# EAGLE schematic main (EAGLE 6.5.0)
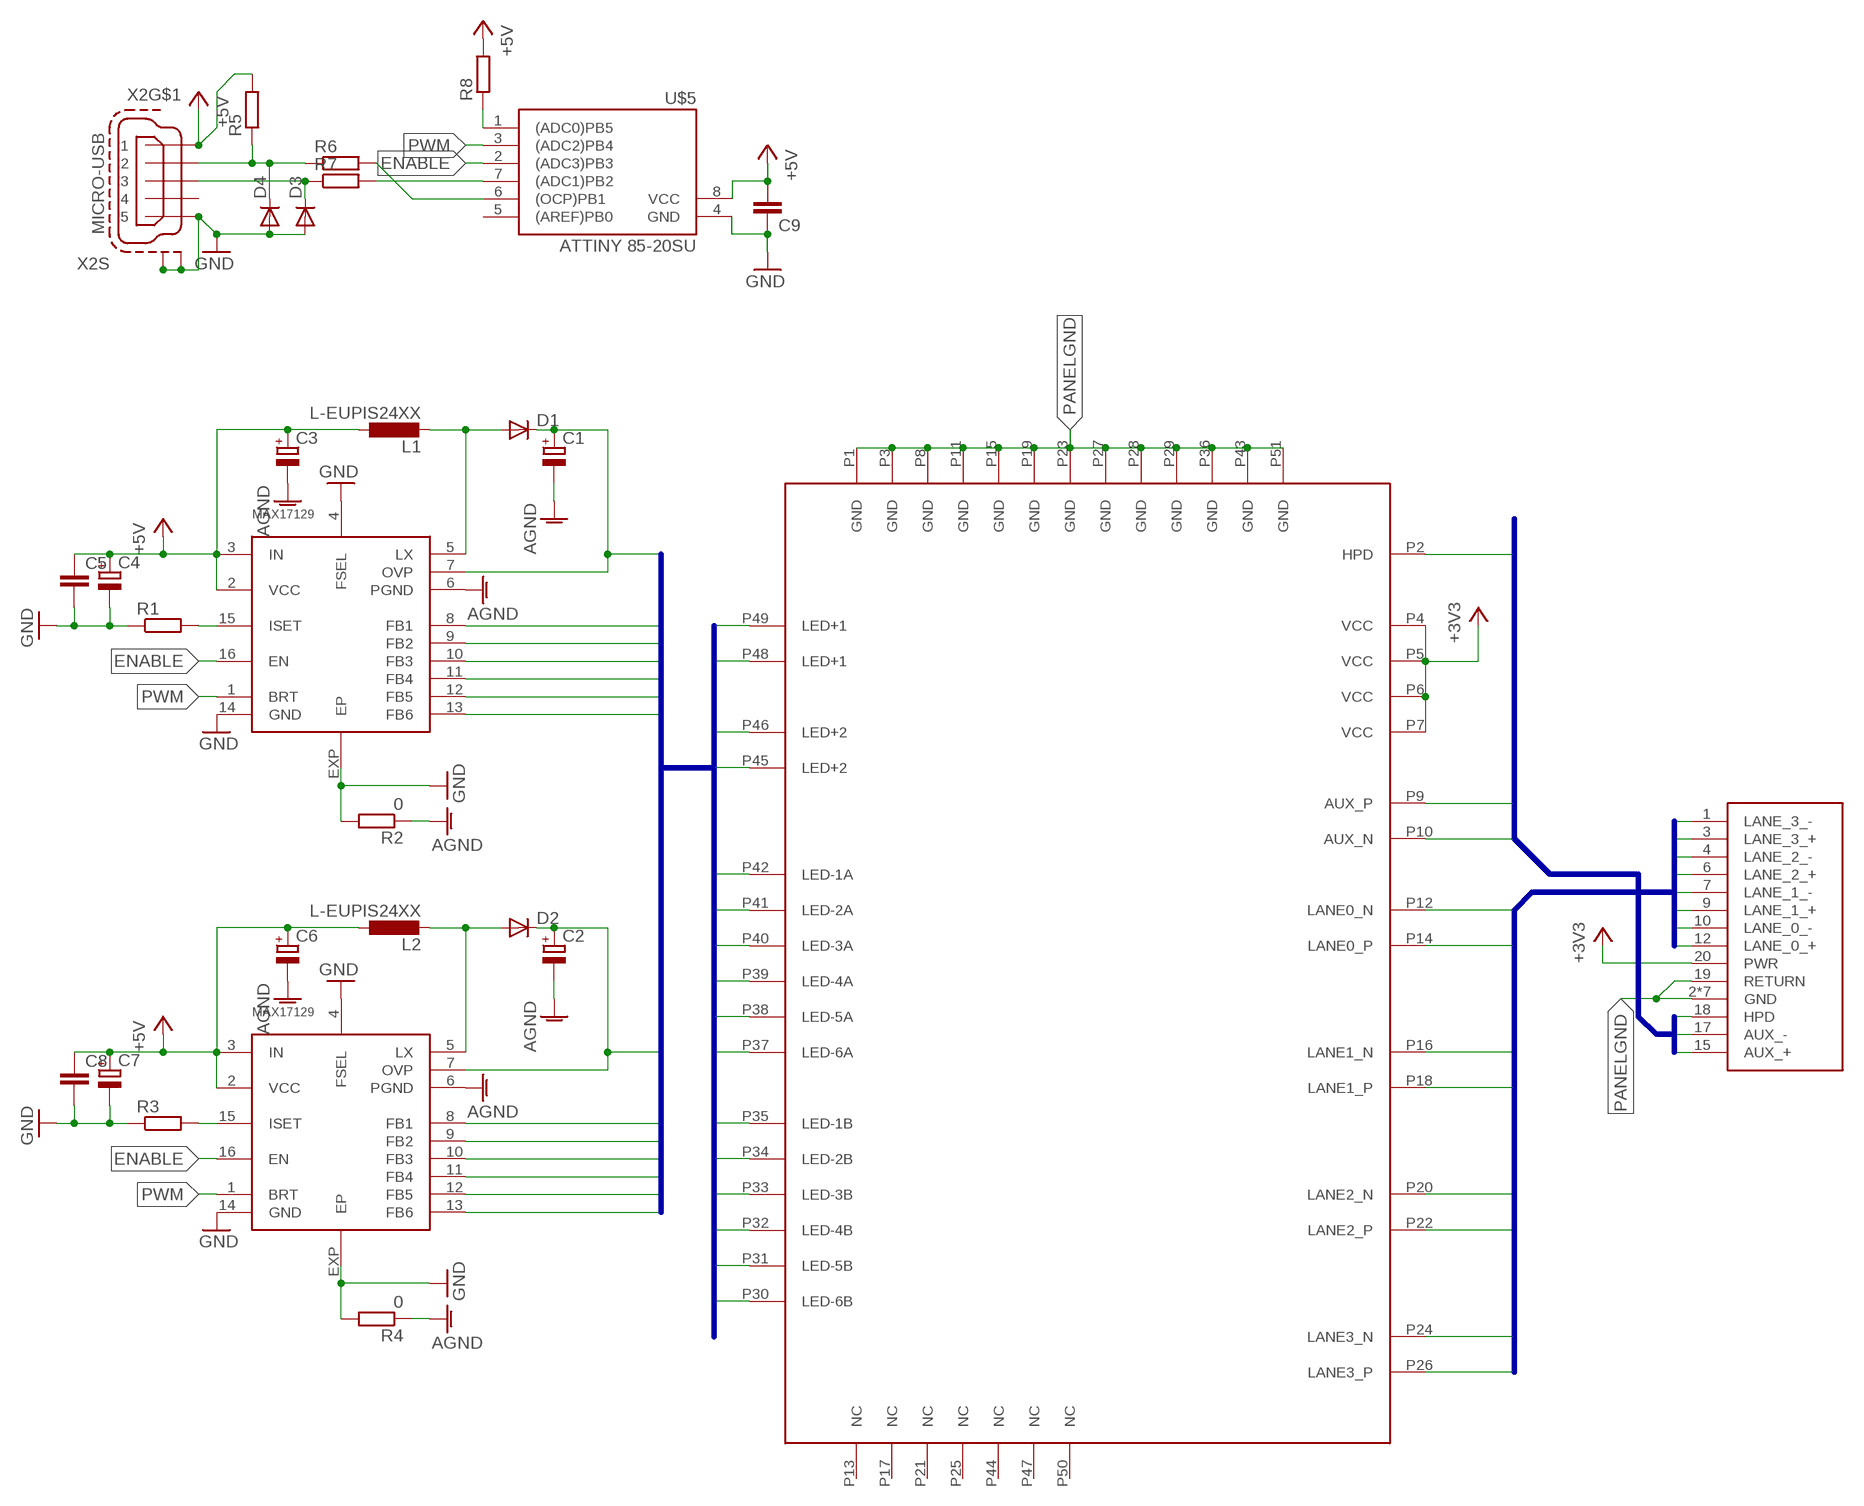
[diagram p0: schematic, sheet 1]

## Parts
C1  CPOL-EUB  [PANASONIC_B]
C2  CPOL-EUB  [PANASONIC_B]
C3  CPOL-EUB  [PANASONIC_B]
C4  CPOL-EUB  [PANASONIC_B]
C5  C-EUC0805  [C0805]
C6  CPOL-EUB  [PANASONIC_B]
C7  CPOL-EUB  [PANASONIC_B]
C8  C-EUC0805  [C0805]
C9  C-EUC0805  [C0805]
D1  DIODE-DO214AA  [DO214AA]
D2  DIODE-DO214AA  [DO214AA]
D3  DIODE-MINIMELF  [MINIMELF]
D4  DIODE-MINIMELF  [MINIMELF]
L1  L-EUPIS24XX  [PIS24XX]
L2  L-EUPIS24XX  [PIS24XX]
R1  R-EU_M0805  [M0805]
R2  0  R-EU_R0201  [R0201]
R3  R-EU_M0805  [M0805]
R4  0  R-EU_R0201  [R0201]
R5  R-EU_R0805  [R0805]
R6  R-EU_R0805  [R0805]
R7  R-EU_R0805  [R0805]
R8  R-EU_R0805  [R0805]
U$1  IPAD3-CONN  [MOLEX502250-5191]
U$2  DP1R020JQ1SINK  [DP1R020JQ1]
U$3  MAX17129  [QFN16-4X4]
U$4  MAX17129  [QFN16-4X4]
U$5  ATTINY 85-20SU  TINY25/45/85-20SU  [SOIC8]
X2  MICRO-USB  [SMD]

## Nets
+3V3: U$1.P4(VCC) U$1.P5(VCC) U$1.P6(VCC) U$1.P7(VCC) U$2.20(PWR)
+5V: C3.+ C4.+ C5.1 C6.+ C7.+ C8.1 C9.2 L1.2 L2.2 R5.2 R8.2 U$3.2(VCC) U$3.3(IN) U$4.2(VCC) U$4.3(IN) U$5.8(VCC) X2.1
AGND: C1.- C2.- C3.- C6.- R2.1 R4.1 U$3.6(PGND) U$4.6(PGND)
AUX_N: U$1.P10(AUX_N) U$2.17(AUX_-)
AUX_P: U$1.P9(AUX_P) U$2.15(AUX_+)
ENABLE: U$3.16(EN) U$4.16(EN) U$5.2((ADC3)PB3)
GND: C4.- C5.2 C7.- C8.2 C9.1 D3.A D4.A R1.1 R2.2 R3.1 R4.2 U$3.4(FSEL) U$3.14(GND) U$3.EXP(EP) U$4.4(FSEL) U$4.14(GND) U$4.EXP(EP) U$5.4(GND) X2.5 X2.GNDA(S:S1) X2.GNDB(S:S2)
HPD: U$1.P2(HPD) U$2.18(HPD)
LANE0_N: U$1.P12(LANE0_N) U$2.10(LANE_0_-)
LANE0_P: U$1.P14(LANE0_P) U$2.12(LANE_0_+)
LANE1_N: U$1.P16(LANE1_N) U$2.7(LANE_1_-)
LANE1_P: U$1.P18(LANE1_P) U$2.9(LANE_1_+)
LANE2_N: U$1.P20(LANE2_N) U$2.4(LANE_2_-)
LANE2_P: U$1.P22(LANE2_P) U$2.6(LANE_2_+)
LANE3_N: U$1.P24(LANE3_N) U$2.1(LANE_3_-)
LANE3_P: U$1.P26(LANE3_P) U$2.3(LANE_3_+)
LED_N_A_1: U$1.P42(LED-1A) U$3.8(FB1)
LED_N_A_2: U$1.P41(LED-2A) U$3.11(FB4)
LED_N_A_3: U$1.P40(LED-3A) U$3.9(FB2)
LED_N_A_4: U$1.P39(LED-4A) U$3.12(FB5)
LED_N_A_5: U$1.P38(LED-5A) U$3.10(FB3)
LED_N_A_6: U$1.P37(LED-6A) U$3.13(FB6)
LED_N_B_1: U$1.P35(LED-1B) U$4.8(FB1)
LED_N_B_2: U$1.P34(LED-2B) U$4.11(FB4)
LED_N_B_3: U$1.P33(LED-3B) U$4.9(FB2)
LED_N_B_4: U$1.P32(LED-4B) U$4.12(FB5)
LED_N_B_5: U$1.P31(LED-5B) U$4.10(FB3)
LED_N_B_6: U$1.P30(LED-6B) U$4.13(FB6)
LED_P_1: C1.+ D1.C U$1.P48(LED+1) U$1.P49(LED+1) U$3.7(OVP)
LED_P_2: C2.+ D2.C U$1.P45(LED+2) U$1.P46(LED+2) U$4.7(OVP)
N$1: R1.2 U$3.15(ISET)
N$2: R3.2 U$4.15(ISET)
N$3: D1.A L1.1 U$3.5(LX)
N$4: D2.A L2.1 U$4.5(LX)
N$9: R6.2 U$5.6((OCP)PB1)
N$10: R7.2 U$5.7((ADC1)PB2)
N$11: D3.C R7.1 X2.3
N$12: D4.C R5.1 R6.1 X2.2
N$13: R8.1 U$5.1((ADC0)PB5)
PANELGND: U$1.P1(GND) U$1.P3(GND) U$1.P8(GND) U$1.P11(GND) U$1.P15(GND) U$1.P19(GND) U$1.P23(GND) U$1.P27(GND) U$1.P28(GND) U$1.P29(GND) U$1.P36(GND) U$1.P43(GND) U$1.P51(GND) U$2.2(GND) U$2.5(GND) U$2.8(GND) U$2.11(GND) U$2.13(GND) U$2.14(GND) U$2.16(GND) U$2.19(RETURN)
PWM: U$3.1(BRT) U$4.1(BRT) U$5.3((ADC2)PB4)
Unconnected: U$1.P13(NC) U$1.P17(NC) U$1.P21(NC) U$1.P25(NC) U$1.P44(NC) U$1.P47(NC) U$1.P50(NC) U$5.5((AREF)PB0) X2.4

## Buses
LANE0_P,LANE0_N,LANE1_P,LANE1_N,LANE2_P,LANE2_N,LANE3_P,LANE3_N
AUX_P,AUX_N,HPD
LED_P_[1..2],LED_N_A_[1..6],LED_N_B_[1..6]

## Library data of the parts
C1-C4 C6 C7 = rcl:CPOL-EU: POLARIZED CAPACITOR, European symbol
C5 C8 C9 = rcl:C-EU: CAPACITOR, European symbol
D1-D4 = diode:DIODE-: DIODE
L1 L2 = Inductor-Fastron:L-EU
R1-R8 = rcl:R-EU_: RESISTOR, European symbol
U$1 = con-ipad3:IPAD3-CONN
U$2 = DP1R020JQ1:DP1R020JQ1
U$3 U$4 = maxim:MAX17129
U$5 = avr-7:TINY25/45/85
X2 = con-usb:MICRO-USB: MINI USB-B Conector Source: www.cypressindustries.com